# EAGLE design 2te8LED_v03 (EAGLE 6.2)
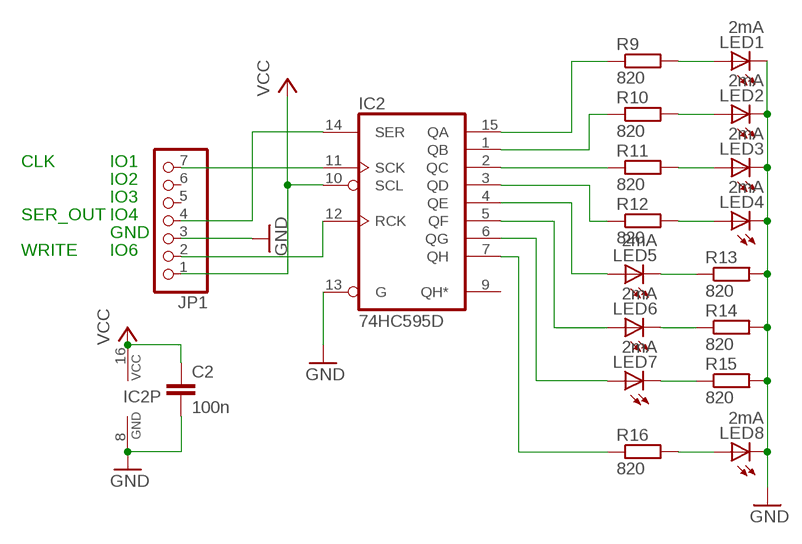
[diagram p0: schematic, sheet 1]

## Parts
C2  100n  C-EU050-024X044  [C050-024X044]
IC2  74HC595D  [SO16]
JP1  PINHD-1X7_2.54  [1X07]
LED1  2mA  LED3MM  [LED3MM]
LED2  2mA  LED3MM  [LED3MM]
LED3  2mA  LED3MM  [LED3MM]
LED4  2mA  LED3MM  [LED3MM]
LED5  2mA  LED3MM  [LED3MM]
LED6  2mA  LED3MM  [LED3MM]
LED7  2mA  LED3MM  [LED3MM]
LED8  2mA  LED3MM  [LED3MM]
R9  820  R-EU_0204/7  [0204/7]
R10  820  R-EU_0204/7  [0204/7]
R11  820  R-EU_0204/7  [0204/7]
R12  820  R-EU_0204/7  [0204/7]
R13  820  R-EU_0204/7  [0204/7]
R14  820  R-EU_0204/7  [0204/7]
R15  820  R-EU_0204/7  [0204/7]
R16  820  R-EU_0204/7  [0204/7]

## Nets
GND: C2.2 IC2.8(GND) IC2.13(G) JP1.3 LED1.K(C) LED2.K(C) LED3.K(C) LED4.K(C) LED8.K(C) R13.2 R14.2 R15.2
IO1: IC2.11(SCK) JP1.7
IO4: IC2.14(SER) JP1.4
IO6: IC2.12(RCK) JP1.2
N$20: IC2.15(QA) R9.1
N$21: IC2.1(QB) R10.1
N$22: IC2.2(QC) R11.1
N$23: IC2.3(QD) R12.1
N$24: IC2.4(QE) LED5.A
N$25: IC2.5(QF) LED6.A
N$26: IC2.6(QG) LED7.A
N$29: LED1.A R9.2
N$30: LED2.A R10.2
N$31: LED3.A R11.2
N$32: LED4.A R12.2
N$33: LED5.K(C) R13.1
N$34: LED6.K(C) R14.1
N$35: LED7.K(C) R15.1
N$36: IC2.7(QH) R16.1
N$37: LED8.A R16.2
VCC: C2.1 IC2.10(SCL) IC2.16(VCC) JP1.1
Unconnected: IC2.9(QH*) JP1.5 JP1.6

## Notes on the sheet
- CLK | IO1
- IO2
- IO3
- SER_OUT | IO4
- GND
- WRITE | IO6

## Library data of the parts
C2 = rcl:C-EU: CAPACITOR, European symbol
IC2 = 74xx-eu:74*595: 8-bit SHIFT REGISTER, output latch
JP1 = pinhead:PINHD-1X7: PIN HEADER
LED1-LED8 = led:LED: LED OSRAM: - CHIPLED LG R971, LG N971, LY N971, LG Q971, LY Q971, LO R971, LY R971 LH N974, LH R974 LS Q976, LO Q976, LY Q976 LO Q996 - Hyper CHIPLED LW Q18S LB Q993, LB Q99A, LB R99A - SideLED LS A670, LO A670, LY A670, LG A670, LP A670 LB A673, LV A673, LT A673, LW A673 LH A674 LY A675 LS A676, LA A676, LO A676, LY A676, LW A676 LS A679, LY A679, LG A679 - Hyper Micro SIDELED® LS Y876, LA Y876, LO Y876, LY Y876 LT Y87S - SmartLED LW L88C, LW L88S LB L89C, LB L89S, LG L890 LS L89K, LO L89K, LY L89K LS L896, LA L896, LO L896, LY L896 - TOPLED LS T670, LO T670, LY T670, LG T670, LP T670 LSG T670, LSP T670, LSY T670, LOP T670, LYG T670 LG T671, LOG T671, LSG T671 LB T673, LV T673, LT T673, LW T673 LH T674 LS T676, LA T676, LO T676, LY T676, LB T676, LH T676, LSB T676, LW T676 LB T67C, LV T67C, LT T67C, LS T67K, LO T67K, LY T67K, LW E67C LS E67B, LA E67B, LO E67B, LY E67B, LB E67C, LV E67C, LT E67C LW T67C LS T679, LY T679, LG T679 LS T770, LO T770, LY T770, LG T770, LP T770 LB T773, LV T773, LT T773, LW T773 LH T774 LS E675, LA E675, LY E675, LS T675 LS T776, LA T776, LO T776, LY T776, LB T776 LHGB T686 LT T68C, LB T68C - Hyper Mini TOPLED® LB M676 - Mini TOPLED Santana® LG M470 LS M47K, LO M47K, LY M47K Source: http://www.osram.convergy.de - LUMILED® LXK2-PW12-R00, LXK2-PW12-S00, LXK2-PW14-U00, LXK2-PW14-V00 LXK2-PM12-R00, LXK2-PM12-S00, LXK2-PM14-U00 LXK2-PE12-Q00, LXK2-PE12-R00, LXK2-PE12-S00, LXK2-PE14-T00, LXK2-PE14-U00 LXK2-PB12-K00, LXK2-PB12-L00, LXK2-PB12-M00, LXK2-PB14-N00, LXK2-PB14-P00, LXK2-PB14-Q00 LXK2-PR12-L00, LXK2-PR12-M00, LXK2-PR14-Q00, LXK2-PR14-R00 LXK2-PD12-Q00, LXK2-PD12-R00, LXK2-PD12-S00 LXK2-PH12-R00, LXK2-PH12-S00 LXK2-PL12-P00, LXK2-PL12-Q00, LXK2-PL12-R00 Source: www.luxeon.com
R9-R16 = rcl:R-EU_: RESISTOR, European symbol

## Board
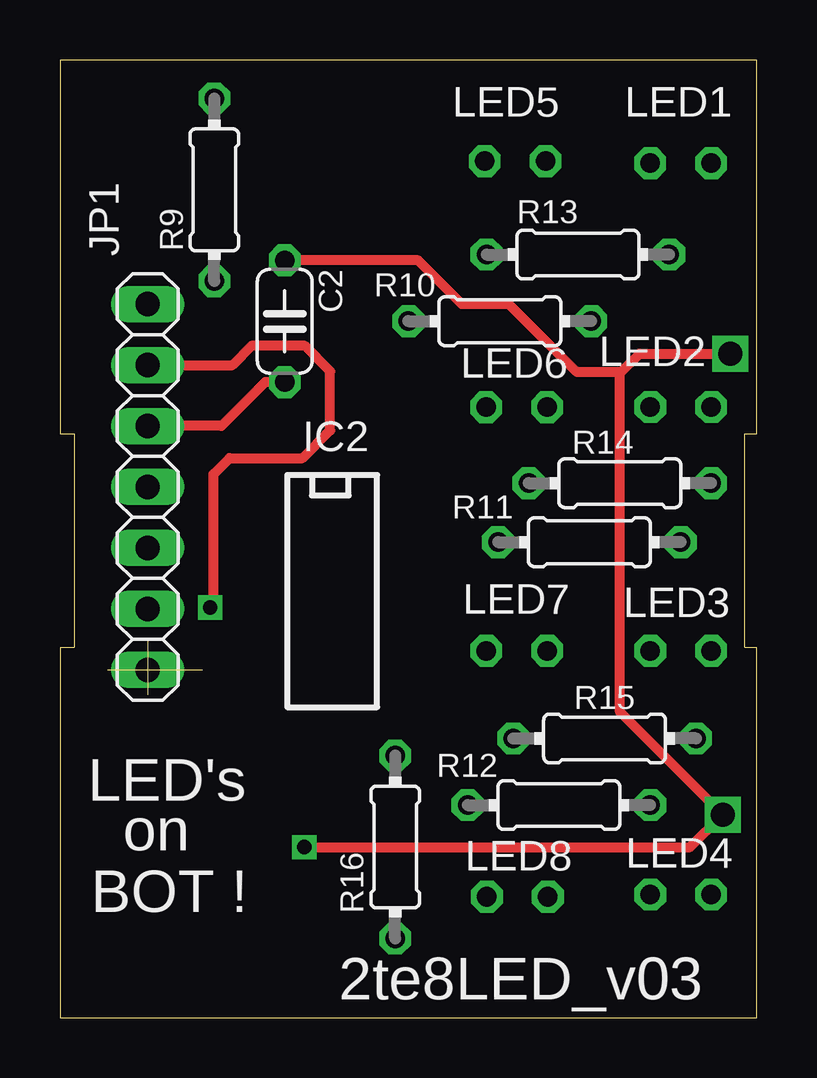
[diagram p1: board, top side]
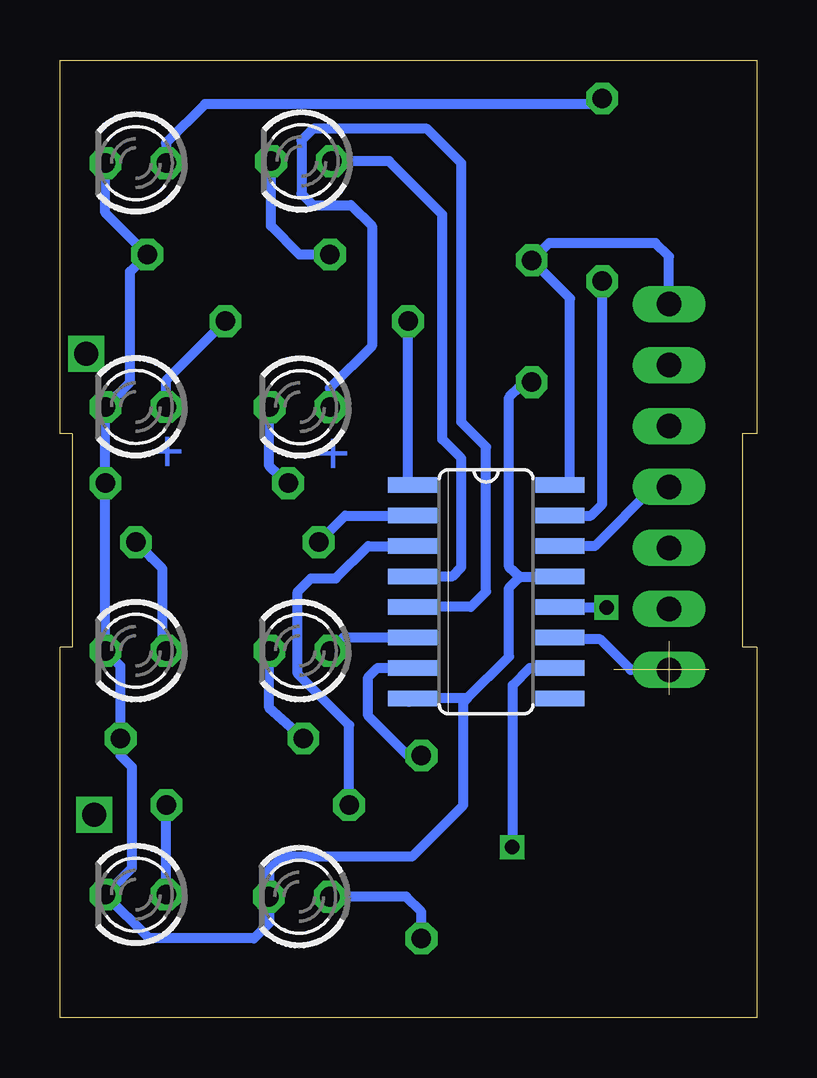
[diagram p2: board, bottom side, seen from below]

Size 29.04 x 39.9 mm. Coordinates in mm from the lower left corner, seen from the top.
Outline: 0,39.9 29.04,39.9 29.04,24.33 28.54,24.33
Outline: 0,39.9 0,24.33 0.6,24.33 0.6,15.43 0,15.43 0,0
Outline: 0,0 29.04,0 29.04,15.43 28.54,15.43
Outline: 28.54,24.33 28.54,15.43
Outline: 3.66,15.68 3.66,13.46
Outline: 1.99,14.49 5.96,14.49
Copper layers (1*16): Top 0.035mm / dielectric 1.5mm / Bottom 0.035mm
Design rules: minimum track width 10mil, minimum drill 24mil, track to track 8mil, track to pad 8mil, pad to pad 8mil, via to via 8mil, smd to smd 8mil, copper to edge 40mil, drill to drill 8mil, minimum pad ring 10mil, minimum via ring 8mil, stop-mask expansion 4mil, vias tented up to drill 0mil, thermal gap 10mil

### Footprints (pad centres in the part's own frame; a part is rotated, then mirrored left to right if it is on the bottom)
C050-024X044 = drill 0.813 octagon: 1 -2.54,0; 2 2.54,0
SO16 = smd 0.66 x 2.032: 1 -4.445,-3.073; 2 -3.175,-3.073; 3 -1.905,-3.073; 4 -0.635,-3.073; 5 0.635,-3.073; 6 1.905,-3.073; 7 3.175,-3.073; 8 4.445,-3.073; 9 4.445,3.073; 10 3.175,3.073; 11 1.905,3.073; 12 0.635,3.073; 13 -0.635,3.073; 14 -1.905,3.073; 15 -3.175,3.073; 16 -4.445,3.073
1X07 = drill 1.016 long: 1 -7.62,0; 2 -5.08,0; 3 -2.54,0; 4 0,0; 5 2.54,0; 6 5.08,0; 7 7.62,0
LED3MM = drill 0.813 octagon: A -1.27,0; K 1.27,0
0204/7 = drill 0.813 octagon: 1 -3.81,0; 2 3.81,0

### Placement (x,y rotation side)
C2  9.37,29.01 270 top
IC2  11.28,17.74 270 bottom
JP1  3.66,22.11 270 top
LED1  25.88,35.6 180 bottom
LED2  25.88,25.44 180 bottom
LED3  25.88,15.28 180 bottom
LED4  25.88,5.12 180 bottom
LED5  18.98,35.68 180 bottom
LED6  19.04,25.43 180 bottom
LED7  19.05,15.28 180 bottom
LED8  19.07,5.04 180 bottom
R9  6.43,34.49 90 top
R10  18.34,29.01 0 top
R11  22.07,19.81 0 top
R12  20.8,8.85 0 top
R13  21.6,31.79 0 top
R14  23.34,22.27 0 top
R15  22.71,11.63 0 top
R16  13.98,7.11 270 top

### Tracks (layer width: path | path; a pad name or v marks a point on that pad's centre or on a via)
GND
  Top 0.406: C2.2 8.55,26.47 6.74,24.66 4.62,24.66 4.62,24.65 JP1.3
  Bottom 0.406: 14.51,13.14 IC2.8 12.07,13.3 | 12.07,13.3 10.32,15.04 10.32,17.9 9.89,18.34 | 9.89,18.34 9.85,18.38 IC2.13 | LED2.K 26.12,26.47 26.12,31.08 R13.2 27.15,33.54 LED1.K | LED2.K | LED2.K 27.15,25.36 27.15,23.7 27.15,23.62 R14.2 LED3.K 26.52,14.65 R15.2 26.52,10.92 26.04,10.44 26.04,6.23 LED4.K 25.33,3.3 20.96,3.3 20.32,3.93 20.32,5.02 LED8.K 20.32,5.05 20.32,6.16 19.77,6.71 14.37,6.71 12.23,8.85 12.23,13.14 12.07,13.3 | 9.89,18.34 9.85,18.34 10.32,18.78 10.32,25.84 9.85,26.32 9.53,26.32 C2.2
IO1
  Bottom 0.406: IC2.11 8.12,15.76 6.51,15.76 5.24,14.49 JP1.7
IO4
  Bottom 0.406: 4.29,22.11 6.75,19.65 IC2.14 | JP1.4 4.29,22.11 | 4.29,22.11
IO6  (via drill 0.6)
  Top 0.406: v6.26,17.09 6.4,17.23 6.4,22.64 7.07,23.31 10.11,23.31 11.27,24.47 11.27,26.93 10.21,27.99 7.99,27.99 7.19,27.19 JP1.2
  Bottom 0.406: v6.26,17.09 8.18,17.09 IC2.12
N$20
  Bottom 0.406: IC2.15 6.91,20.92 6.43,21.39 R9.1
N$21
  Bottom 0.406: R10.1 14.53,22.37 IC2.1
N$22
  Bottom 0.406: R11.1 17.86,20.2 17.15,20.92 IC2.2
N$23
  Bottom 0.406: R12.1 16.99,12.19 19.13,14.33 19.13,17.74 18.58,18.3 17.55,18.3 16.2,19.65 IC2.3
N$24
  Bottom 0.406: LED5.A 15.32,35.68 13.1,33.46 13.1,24.09 12.31,23.3 12.31,18.78 12.7,18.38 IC2.4
N$25
  Bottom 0.406: IC2.5 11.91,17.11 11.28,17.74 11.28,23.78 12.31,24.81 12.31,35.6 13.74,37.03 18.5,37.03 18.98,36.56 18.98,34.33 18.5,33.86 16.91,33.86 16.04,32.98 16.04,27.98 17.78,26.24 17.78,25.45 LED6.A
N$26
  Bottom 0.406: IC2.6 17.23,15.84 17.23,15.83 LED7.A
N$29
  Bottom 0.406: R9.2 6.28,38.06 23,38.06 24.62,36.44 LED1.A
N$30
  Bottom 0.406: R10.2 24.61,26.55 LED2.A
N$31
  Bottom 0.406: LED3.A 24.77,15.44 24.77,18.7 25.25,19.17 R11.2
N$32
  Bottom 0.406: LED4.A R12.2
N$33
  Bottom 0.406: LED5.K 20.25,32.98 19.05,31.79 17.94,31.79 R13.1
N$34
  Bottom 0.406: 20.25,22.9 20.32,22.98 20.32,25.41 LED6.K | 20.25,22.9 | R14.1 20.25,22.9
N$35
  Bottom 0.406: R15.1 20.32,12.9 LED7.K
N$36
  Bottom 0.406: IC2.7 15.8,14.57 16.2,14.17 16.2,12.58 14.53,10.92 R16.1
N$37
  Bottom 0.406: R16.2 13.97,4.41 14.61,5.04 LED8.A
VCC  (via drill 0.6, 1 pad 1.42)
  Top 0.406: v27.94,27.67 24.17,27.67 23.35,26.84 | 23.35,26.84 23.35,12.74 v27.63,8.46 26.27,7.1 v10.19,7.1 | 23.35,26.84 23.29,26.9 21.56,26.9 18.73,29.73 16.76,29.73 14.93,31.55 C2.1 | C2.1
  Bottom 0.406: IC2.10 9.45,14.57 10.16,13.85 10.16,7.12 v10.19,7.1 | IC2.16 7.78,22.19 7.78,29.97 C2.1 | C2.1 | JP1.1 3.66,31.71 4.21,32.27 8.66,32.27 C2.1

### Text on the board
Bottom: + | +
tPlace: LED's | on | BOT ! | 2te8LED_v03